# EAGLE design HTS221_breakout (EAGLE 7.4.0)
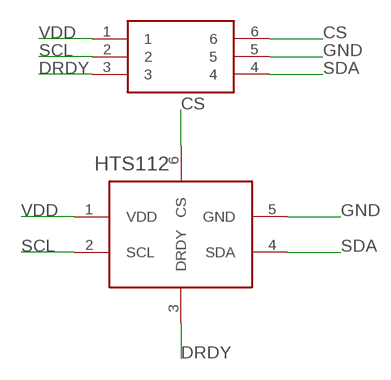
[diagram p0: schematic, sheet 1]

## Parts
HTS112  ST-HTS221  [ST-HTS221]
U$1  6PIN  [6PIN]

## Nets
CS: HTS112.6(CS) U$1.6
DRDY: HTS112.3(DRDY) U$1.3
GND: HTS112.5(GND) U$1.5
SCL: HTS112.2(SCL) U$1.2
SDA: HTS112.4(SDA) U$1.4
VDD: HTS112.1(VDD) U$1.1

## Library data of the parts
HTS112 = FaBo-Mems:ST-HTS221
U$1 = FaBo-Breakout:6PIN

## Board
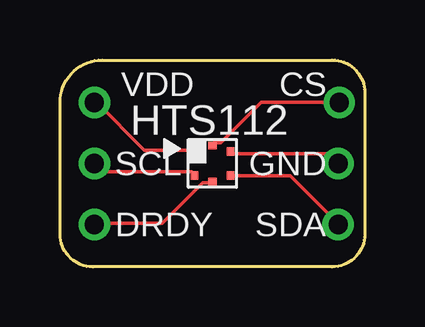
[diagram p1: board, top side]

Size 12.7 x 8.62 mm. Coordinates in mm from the lower left corner, seen from the top.
Copper layers (1*16): Top 0.035mm / dielectric 1.5mm / Bottom 0.035mm
Design rules "SeeedStudio_2layer_DRU_no_angle_20140221": minimum track width 6mil, minimum drill 12mil, track to track 6mil, track to pad 6mil, pad to pad 6mil, via to via 6mil, smd to smd 0mil, copper to edge 10mil, drill to drill 10mil, minimum pad ring 10mil, minimum via ring 6mil, stop-mask expansion 2mil, vias tented up to drill 100mil, thermal gap 10mil

### Footprints (pad centres in the part's own frame; a part is rotated, then mirrored left to right if it is on the bottom)
ST-HTS221 = smd 0.3 x 0.35: 1 -0.75,0.5; 2 -0.75,-0.5; 4 0.75,-0.5; 5 0.75,0.5 | smd 0.35 x 0.3: 3 0,-0.75; 6 0,0.75
6PIN = drill 0.8: 1 -4.92,2.54; 2 -4.92,0; 3 -4.92,-2.54; 4 5.24,-2.54; 5 5.24,0; 6 5.283,2.54

### Placement (x,y rotation side)
HTS112  6.35,4.31 0 top
U$1  6.35,4.31 0 top

### Tracks (layer width: path | path; a pad name or v marks a point on that pad's centre or on a via)
CS
  Top 0.152: U$1.6 8.38,6.85 6.71,5.17 6.4,5.17 HTS112.6
DRDY
  Top 0.152: HTS112.3 6.25,3.5 5.94,3.5 4.27,1.82 1.52,1.82 U$1.3
GND
  Top 0.152: HTS112.5 7.16,4.72 11.28,4.72 11.58,4.41 U$1.5
SCL
  Top 0.152: HTS112.2 5.49,3.95 1.83,3.95 1.52,4.26 U$1.2
SDA
  Top 0.152: HTS112.4 7.16,3.8 9.6,3.8 11.58,1.82 U$1.4
VDD
  Top 0.152: HTS112.1 5.49,4.87 3.5,4.87 1.52,6.85 U$1.1

### Text on the board
tPlace: VDD | CS | SCL | GND | DRDY | SDA